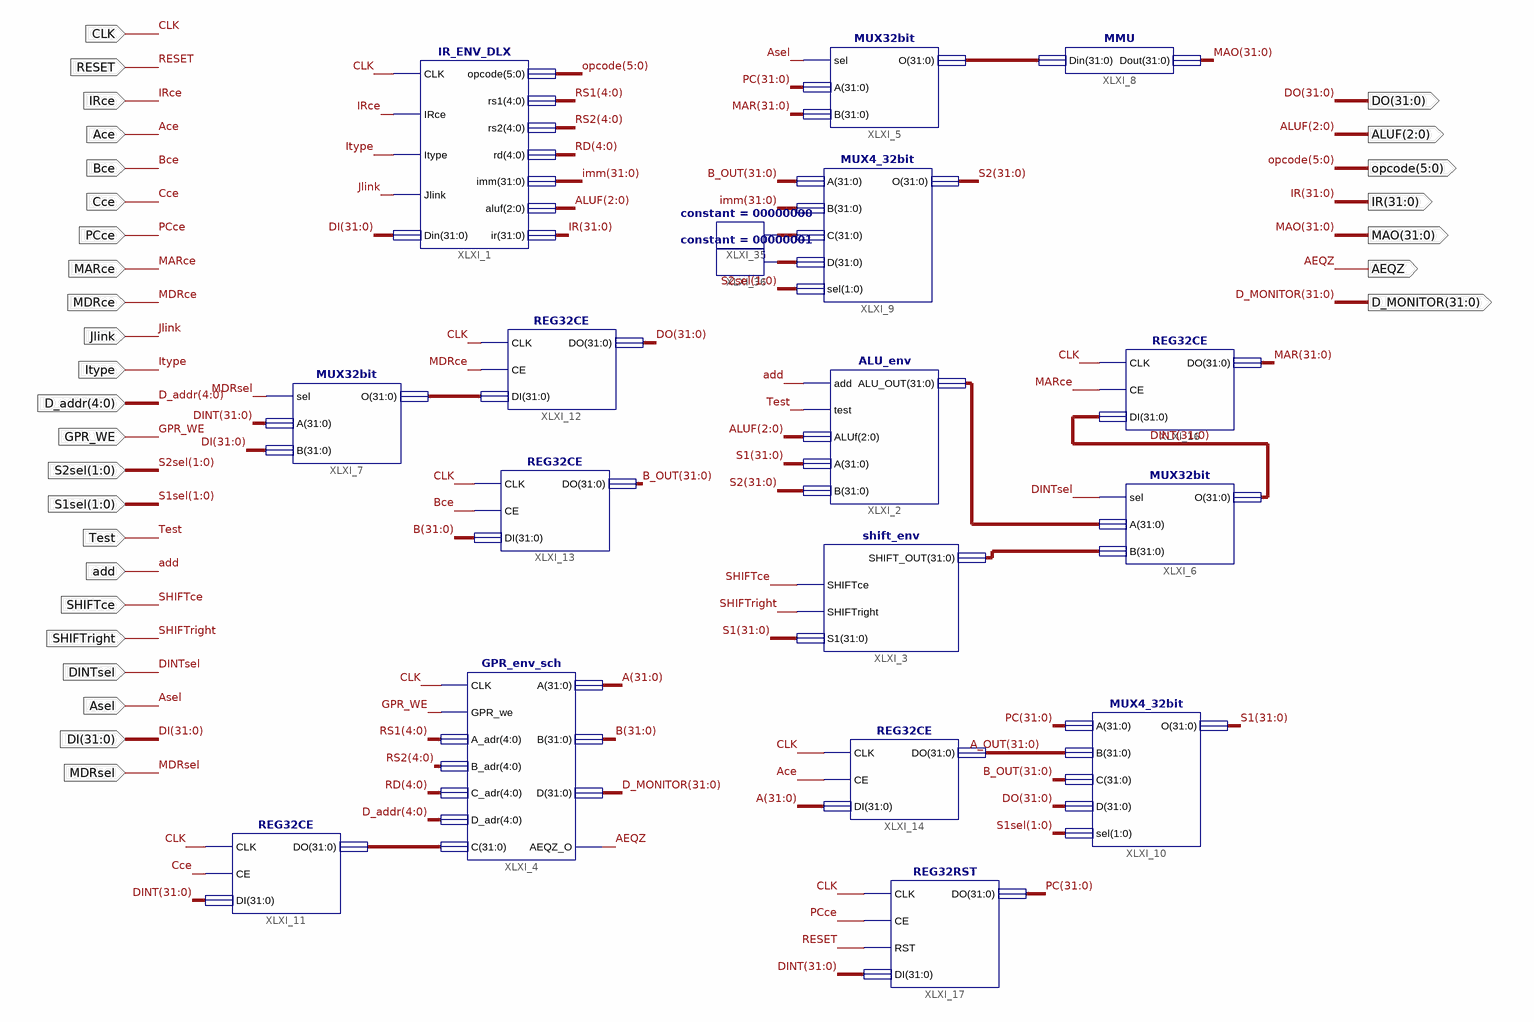
[diagram p0: schematic sheet 1]
// Xilinx ISE schematic DATAPATH.sch (spartan6) as structural Verilog: 18 symbols, 30 ports
module DATAPATH (
  input  RESET,
  input  CLK,
  input  IRce,
  input  Bce,
  input  Ace,
  input  Cce,
  input  MARce,
  input  PCce,
  input  MDRce,
  input  Itype,
  input  Jlink,
  input  [4:0] D_addr,
  input  [1:0] S2sel,
  input  GPR_WE,
  input  add,
  input  Test,
  input  SHIFTce,
  input  DINTsel,
  input  Asel,
  input  [31:0] DI,
  input  SHIFTright,
  input  [1:0] S1sel,
  input  MDRsel,
  output [2:0] ALUF,
  output [31:0] DO,
  output [5:0] opcode,
  output [31:0] MAO,
  output [31:0] IR,
  output AEQZ,
  output [31:0] D_MONITOR
);

  wire [4:0] RD, RS1, RS2;
  wire [31:0] A, A_OUT, B, B_OUT, DINT, imm, MAR, PC, S1, S2, XLXN_34, XLXN_38, XLXN_39, XLXN_40, XLXN_58,
       XLXN_60, XLXN_71;

  IR_ENV_DLX XLXI_1 (
    .CLK(CLK), .IRce(IRce), .Itype(Itype), .Jlink(Jlink), .Din(DI), .opcode(opcode), .rs1(RS1), .rs2(RS2),
    .rd(RD), .imm(imm), .aluf(ALUF), .ir(IR));
  MUX32bit XLXI_5 (.sel(Asel), .A(PC), .B(MAR), .O(XLXN_40));
  MMU XLXI_8 (.Din(XLXN_40), .Dout(MAO));
  MUX4_32bit XLXI_9 (.A(B_OUT), .B(imm), .C(XLXN_58), .D(XLXN_60), .sel(S2sel), .O(S2));
  REG32RST XLXI_17 (.CLK(CLK), .CE(PCce), .RST(RESET), .DI(DINT), .DO(PC));
  MUX32bit XLXI_7 (.sel(MDRsel), .A(DINT), .B(DI), .O(XLXN_71));
  GPR_env_sch XLXI_4 (
    .CLK(CLK), .GPR_we(GPR_WE), .A_adr(RS1), .B_adr(RS2), .C_adr(RD), .D_adr(D_addr), .C(XLXN_34), .A(A),
    .B(B), .D(D_MONITOR), .AEQZ_O(AEQZ));
  REG32CE XLXI_11 (.CLK(CLK), .CE(Cce), .DI(DINT), .DO(XLXN_34));
  MUX4_32bit XLXI_10 (.A(PC), .B(A_OUT), .C(B_OUT), .D(DO), .sel(S1sel), .O(S1));
  ALU_env XLXI_2 (.add(add), .test(Test), .ALUf(ALUF), .A(S1), .B(S2), .ALU_OUT(XLXN_38));
  shift_env XLXI_3 (.SHIFTce(SHIFTce), .SHIFTright(SHIFTright), .SHIFT_OUT(XLXN_39), .S1(S1));
  MUX32bit XLXI_6 (.sel(DINTsel), .A(XLXN_38), .B(XLXN_39), .O(DINT));
  REG32CE XLXI_16 (.CLK(CLK), .CE(MARce), .DI(DINT), .DO(MAR));
  REG32CE XLXI_13 (.CLK(CLK), .CE(Bce), .DI(B), .DO(B_OUT));
  REG32CE XLXI_12 (.CLK(CLK), .CE(MDRce), .DI(XLXN_71), .DO(DO));
  REG32CE XLXI_14 (.CLK(CLK), .CE(Ace), .DI(A), .DO(A_OUT));
  constant #(.CValue("00000000")) XLXI_35 (.O(XLXN_58));
  constant #(.CValue("00000001")) XLXI_36 (.O(XLXN_60));
endmodule
